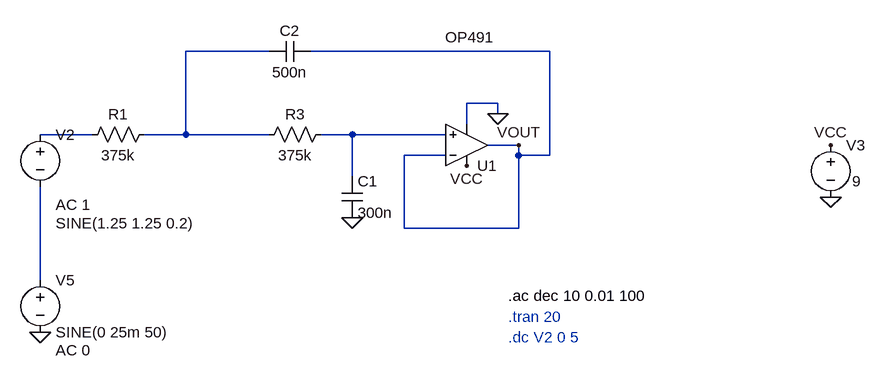
[diagram p0: schematic TempFilter2.asc]
TempFilter2.asc, the LTspice schematic file:
Version 4
SHEET 1 904 680
WIRE -16 16 -144 16
WIRE 416 16 48 16
WIRE 336 96 288 96
WIRE 336 112 336 96
WIRE 288 128 288 96
WIRE -288 144 -368 144
WIRE -144 144 -144 16
WIRE -144 144 -208 144
WIRE -16 144 -144 144
WIRE 112 144 64 144
WIRE 256 144 112 144
WIRE 368 160 320 160
WIRE 256 176 192 176
WIRE 368 176 368 160
WIRE 416 176 416 16
WIRE 416 176 368 176
WIRE 112 208 112 144
WIRE 192 288 192 176
WIRE 368 288 368 176
WIRE 368 288 192 288
WIRE -368 368 -368 224
FLAG 336 112 0
FLAG 848 240 0
FLAG 848 160 VCC
FLAG 288 192 VCC
FLAG 368 160 VOUT
FLAG 112 272 0
FLAG -368 448 0
SYMBOL res -192 128 R90
WINDOW 0 0 56 VBottom 2
WINDOW 3 32 56 VTop 2
SYMATTR InstName R1
SYMATTR Value 375k
SYMBOL voltage 848 144 R0
WINDOW 3 33 72 Left 2
WINDOW 123 0 0 Left 0
WINDOW 39 0 0 Left 0
SYMATTR Value 9
SYMATTR InstName V3
SYMBOL OpAmps\\OP491 288 224 M180
WINDOW 3 -33 230 Left 2
SYMATTR InstName U1
SYMBOL cap 96 208 R0
SYMATTR InstName C1
SYMATTR Value 300n
SYMBOL res 80 128 R90
WINDOW 0 0 56 VBottom 2
WINDOW 3 32 56 VTop 2
SYMATTR InstName R3
SYMATTR Value 375k
SYMBOL cap 48 0 R90
WINDOW 0 0 32 VBottom 2
WINDOW 3 32 32 VTop 2
SYMATTR InstName C2
SYMATTR Value 500n
SYMBOL voltage -368 128 R0
WINDOW 3 24 152 Left 2
WINDOW 123 24 124 Left 2
WINDOW 39 0 0 Left 0
SYMATTR Value SINE(1.25 1.25 0.2)
SYMATTR Value2 AC 1
SYMATTR InstName V2
SYMBOL voltage -368 352 R0
WINDOW 123 24 124 Left 2
WINDOW 39 0 0 Left 0
SYMATTR Value2 AC 0
SYMATTR InstName V5
SYMATTR Value SINE(0 25m 50)
TEXT 352 392 Left 2 !.ac dec 10 0.01 100
TEXT 352 424 Left 2 ;.tran 20
TEXT 352 456 Left 2 ;.dc V2 0 5

The netlist it stands for:
* TempFilter2.asc
R1 N001 N002 375k
V3 VCC 0 9
XU1 N003 VOUT VCC 0 VOUT OP491  ; pins In+ In- V+ V- OUT
C1 N003 0 300n
R3 N003 N001 375k
C2 VOUT N001 500n
V2 N002 N004 SINE(1.25 1.25 0.2) AC 1
V5 N004 0 SINE(0 25m 50) AC 0
.ac dec 10 0.01 100
* .tran 20
* .dc V2 0 5
.backanno
.end